# Altium schematic sheet 3-Axis_Accelerometer.SchDoc: 3-Axis Accelerometer
size A4
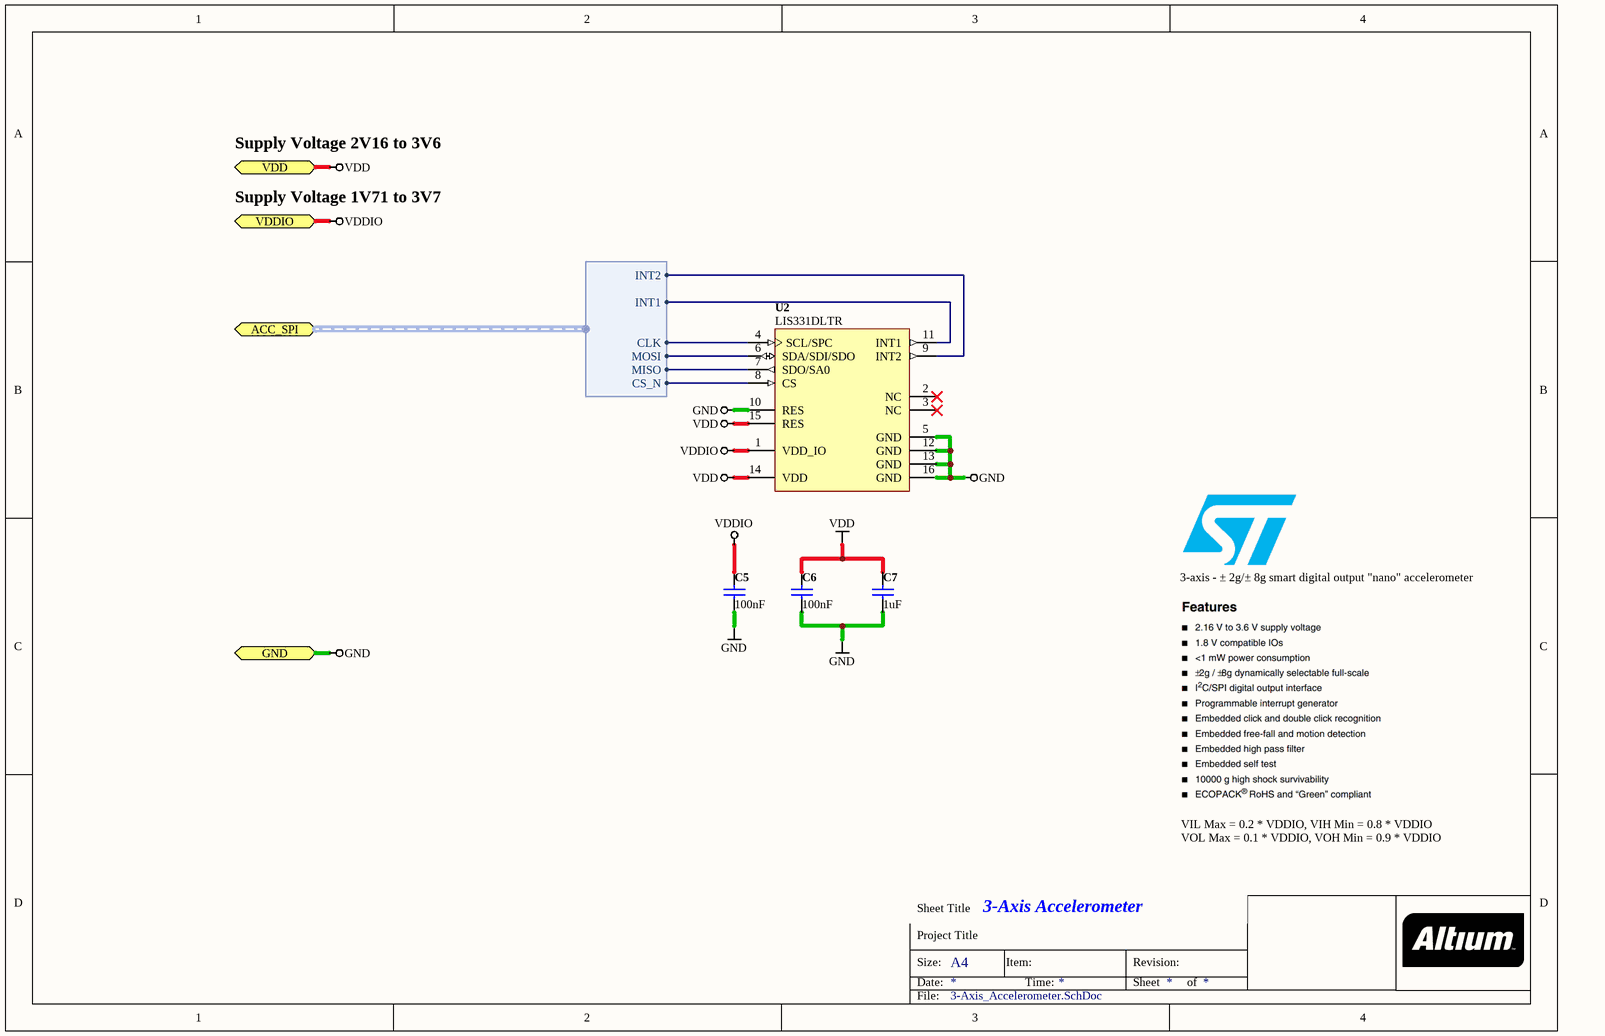
[diagram p0: 3-Axis_Accelerometer.SchDoc]

## Parts
C5  value 100nF  [CAPC0402(1005)60_N]  (hidden comment: CAP 100nF 16V 0402(1005))
C6  value 100nF  [CAPC0402(1005)60_N]  (hidden comment: CAP 100nF 16V 0402(1005))
C7  value 1uF  [CAPC0402(1005)60_N]  (hidden comment: CAP 1uF 16V 0402(1005))
U2  LIS331DLTR  [LGA16-3X3X1_L]

## Ports
ACC_SPI (harness ACC_SPI), GND, VDD, VDDIO

## Harnesses
ACC_SPI: CLK, CS_N, MOSI, MISO, INT1, INT2

## Nets
GND: C5.2 C6.2 C7.1 U2.5(GND) U2.10(RES) U2.12(GND) U2.13(GND) U2.16(GND) ; port GND
VDD: C6.1 C7.2 U2.14(VDD) U2.15(RES) ; port VDD
VDDIO: C5.1 U2.1(VDD_IO) ; port VDDIO
NetU2_4: U2.4(SCL/SPC) ; port ACC_SPI.CLK
NetU2_6: U2.6(SDA/SDI/SDO) ; port ACC_SPI.MOSI
NetU2_7: U2.7(SDO/SA0) ; port ACC_SPI.MISO
NetU2_8: U2.8(CS) ; port ACC_SPI.CS_N
NetU2_9: U2.9(INT2) ; port ACC_SPI.INT2
NetU2_11: U2.11(INT1) ; port ACC_SPI.INT1

Not connected (* = marked no-connect by the designer): U2 2(NC)* 3(NC)*

## Notes on the sheet
- Supply Voltage 2V16 to 3V6
- Supply Voltage 1V71 to 3V7
- 3-axis - ± 2g/± 8g smart digital output "nano" accelerometer
- VIL Max = 0.2 * VDDIO, VIH Min = 0.8 * VDDIO
  VOL Max = 0.1 * VDDIO, VOH Min = 0.9 * VDDIO
- Sheet Title
- Project Title
- Size:
- Date:
- A4
- Item:
- Time:
- Revision:
- Sheet
- of
- File:

## Library data of the parts
C5 C6 = CMP-1034-02069-1: CAP 100nF 16V ?0% 0402 (1005 Metric) Thickness 0.6mm SMD; Case-EIA: 0402; Case-Metric: 1005; Max Thickness: 0.6 mm; Tolerance: ?0%; Rated Voltage: 16 V; Technology: SMT
C7 = CMP-1034-02119-1: CAP 1uF 16V ?0% 0402 (1005 Metric) Thickness 0.6mm SMD; Case-EIA: 0402; Case-Metric: 1005; Technology: SMT; Rated Voltage: 16 V; Tolerance: ?0%; Max Thickness: 0.6 mm
U2 = CMP-0234-00061-2: MEMS motion sensor 3-axis - ± 2g/± 8g smart digital output nano accelerometer, -40 to +85°C, LGA-16 (3x3x1), Tape and Reel; Manufacturer: STMicroelectronics; ComponentLink3URL: http://www.st.com/internet/analog/product/191236.jsp; PackageVersion: 2008; ComponentLink2Description: LIS331DL Datasheet; ComponentLink1Description: Manufacturer URL; ComponentLink2URL: http://www.st.com/internet/com/TECHNICAL_RESOURCES/TECHNICAL_LITERATURE/DATASHEET/CD00172345.pdf; RevisionNote: PCB layout corrected.; PackageDescription: 16-Pin Land Grid Array, 3 x 3 x 1 mm Body, 0.5 mm Pitch; DatasheetVersion: rev3, Apr-2008; ComponentLink3Description: LIS331DL Web Page; PackageReference: LGA16-3X3X1; ComponentLink1URL: http://www.st.com/